# Altium schematic sheet x-Link.SchDoc: =GlobalProjectName
size 594 x 420 mm; CheckedBy: A_D; Author: A_D; SheetTotal: 1; PageSetup: Record=PageOptions|CenterHorizontal=True|CenterVertical=True|PrintScale=0.70|XCorrection=1.00|YCorrection=1.00|PrintKind=2|BorderSize=5000000|LeftOffset=9000|BottomOffset=10100|Orientation=2|PaperLength=11176|PaperWidth=8636|Scale=100|PaperSource=259|PrintQuality=-3|MediaType=1|DitherType=10|PrintScaleMode=1|PaperKind=A3|PaperIndex=8
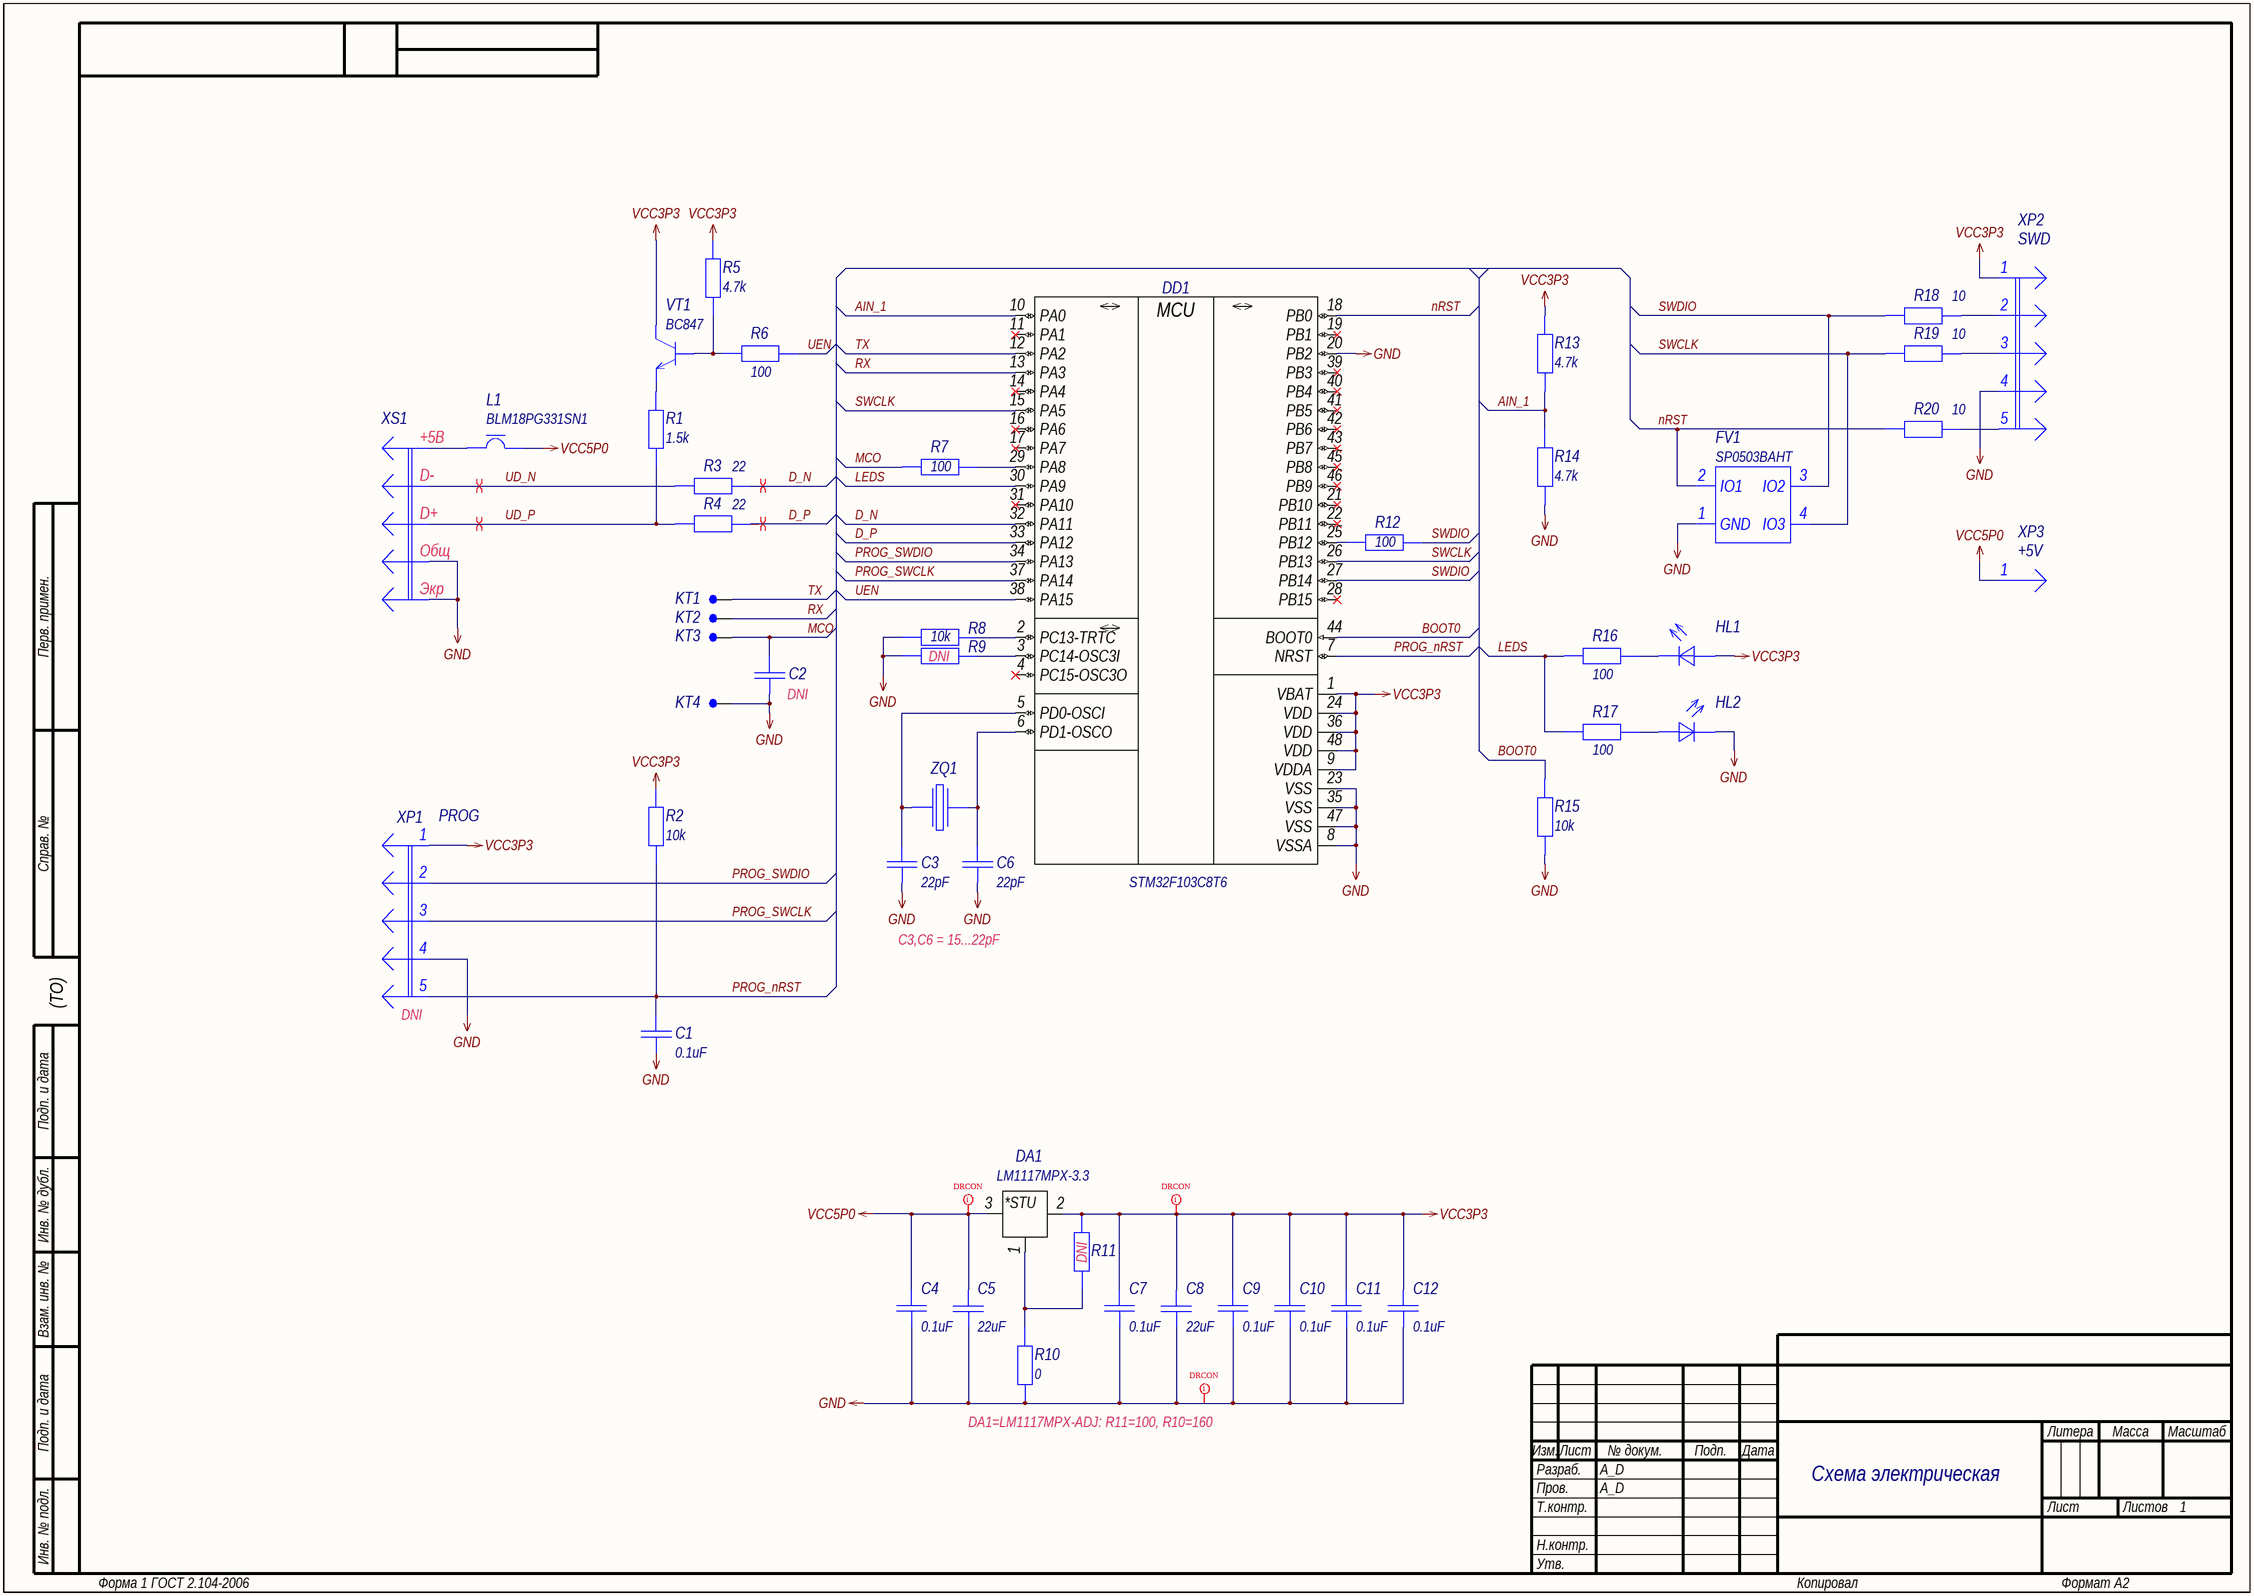
[diagram p0: x-Link.SchDoc]

## Parts
C1  value 0.1uF  [C0603_L]  (hidden comment: Capacitor)
C2  Capacitor  [C0603_L]  (value not drawn)  (no BOM)
C3  value 22pF  [C0603_L]  (hidden comment: Capacitor)
C4  value 0.1uF  [C0603_L]  (hidden comment: Capacitor)
C5  value 22uF  [C0805_L]  (hidden comment: Capacitor)
C6  value 22pF  [C0603_L]  (hidden comment: Capacitor)
C7  value 0.1uF  [C0603_L]  (hidden comment: Capacitor)
C8  value 22uF  [C0805_L]  (hidden comment: Capacitor)
C9  value 0.1uF  [C0603_L]  (hidden comment: Capacitor)
C10  value 0.1uF  [C0603_L]  (hidden comment: Capacitor)
C11  value 0.1uF  [C0603_L]  (hidden comment: Capacitor)
C12  value 0.1uF  [C0603_L]  (hidden comment: Capacitor)
DA1  value LM1117MPX-3.3  [SOT-223]  (hidden comment: LM1117-Series)
DD1  value STM32F103C8T6  [LQFP-48]  (hidden comment: STM32F103Cxxx-Series)
FV1  SP0503BAHT  [SOT-143]
HL1  Text  [LD0603_L]  (value not drawn)
HL2  Text  [LD0603_L]  (value not drawn)
KT1  TX  [TP-SMT-C-1mm-1]  (value not drawn)  (no BOM)
KT2  RX  [TP-SMT-C-1mm-1]  (value not drawn)  (no BOM)
KT3  MCO  [TP-SMT-C-1mm-1]  (value not drawn)  (no BOM)
KT4  GND  [TP-SMT-C-1mm-1]  (value not drawn)  (no BOM)
L1  value BLM18PG331SN1  [L0603_L]  (hidden comment: FerriteBead)
R1  value 1.5k  [R0603_L]  (hidden comment: Resistor)
R2  value 10k  [R0603_L]  (hidden comment: Resistor)
R3  value 22  [R0603_L]  (hidden comment: Resistor)
R4  value 22  [R0603_L]  (hidden comment: Resistor)
R5  value 4.7k  [R0603_L]  (hidden comment: Resistor)
R6  value 100  [R0603_L]  (hidden comment: Resistor)
R7  value 100  [R0603_L]  (hidden comment: Resistor)
R8  value 10k  [R0603_L]  (hidden comment: Resistor)
R9  Resistor  [R0603_L]  (value not drawn)  (no BOM)
R10  value 0  [R0603_L]  (hidden comment: Resistor)
R11  Resistor  [R0603_L]  (value not drawn)  (no BOM)
R12  value 100  [R0603_L]  (hidden comment: Resistor)
R13  value 4.7k  [R0603_L]  (hidden comment: Resistor)
R14  value 4.7k  [R0603_L]  (hidden comment: Resistor)
R15  value 10k  [R0603_L]  (hidden comment: Resistor)
R16  value 100  [R0603_L]  (hidden comment: Resistor)
R17  value 100  [R0603_L]  (hidden comment: Resistor)
R18  value 10  [R0603_L]  (hidden comment: Resistor)
R19  value 10  [R0603_L]  (hidden comment: Resistor)
R20  value 10  [R0603_L]  (hidden comment: Resistor)
VT1  value BC847  [SOT-23]  (hidden comment: BJT-NPN)
XP1  PROG  [PLS-5]  (no BOM)
XP2  SWD  [PLS-5]
XP3  +5V  [PLS-1]
XS1  Text  [DS1097]  (value not drawn)
ZQ1  Crystal  [SMD 5x3.2mm]  (value not drawn)

## Nets
GND: C1.1 C2.1 C3.1 C4.1 C5.2 C6.1 C7.1 C8.2 C9.1 C10.1 C11.1 C12.1 DD1.8(VSSA) DD1.20(PB2) DD1.23(VSS) DD1.35(VSS) DD1.47(VSS) FV1.1(GND) HL2.2(К) KT4.1 R8.1 R9.1 R10.1 R14.1 R15.1 XP1.4 XP2.4 XS1.4 XS1.5
VCC3P3: C7.2 C8.1 C9.2 C10.2 C11.2 C12.2 DA1.2(Out) DD1.1(VBAT) DD1.9(VDDA) DD1.24(VDD) DD1.36(VDD) DD1.48(VDD) HL1.1(А) R2.1 R5.2 R11.2 R13.2 VT1.2(К) XP1.1 XP2.1
VCC5P0: C4.2 C5.1 DA1.3(In) L1.2 XP3.1
AIN_1: DD1.10(PA0) R13.1 R14.2
BOOT0: DD1.44(BOOT0) R15.2
D_N: DD1.32(PA11) R3.2
D_P: DD1.33(PA12) R4.2
LEDS: DD1.30(PA9) R16.2 R17.2
MCO: C2.2 KT3.1 R7.2
nRST: DD1.18(PB0) FV1.2(IO1) R20.1
PROG_nRST: C1.2 DD1.7(NRST) R2.2 XP1.5
PROG_SWCLK: DD1.37(PA14) XP1.3
PROG_SWDIO: DD1.34(PA13) XP1.2
RX: DD1.13(PA3) KT2.1
SWCLK: DD1.15(PA5) DD1.26(PB13) FV1.4(IO3) R19.1
SWDIO: DD1.27(PB14) FV1.3(IO2) R12.2 R18.1
TX: DD1.12(PA2) KT1.1
UD_N: R3.1 XS1.2
UD_P: R1.1 R4.1 XS1.3
UEN: DD1.38(PA15) R6.1
NetC3_2: C3.2 DD1.5(PD0-OSCI) ZQ1.1
NetC6_2: C6.2 DD1.6(PD1-OSCO) ZQ1.3
NetDA1_1: DA1.1(Adj/GND) R10.2 R11.1
NetDD1_2: DD1.2(PC13-TRTC) R8.2
NetDD1_3: DD1.3(PC14-OSC3I) R9.2
NetDD1_25: DD1.25(PB12) R12.1
NetDD1_29: DD1.29(PA8) R7.1
NetHL1_2: HL1.2(К) R16.1
NetHL2_1: HL2.1(А) R17.1
NetL1_1: L1.1 XS1.1
NetR1_2: R1.2 VT1.3(Э)
NetR5_1: R5.1 R6.2 VT1.1(Б)
NetR18_2: R18.2 XP2.2
NetR19_2: R19.2 XP2.3
NetR20_2: R20.2 XP2.5

Not connected (* = marked no-connect by the designer): DD1 4(PC15-OSC3O)* 11(PA1)* 14(PA4)* 16(PA6)* 17(PA7)* 19(PB1)* 21(PB10)* 22(PB11)* 28(PB15)* 31(PA10)* 39(PB3)* 40(PB4)* 41(PB5)* 42(PB6)* 43(PB7)* 45(PB8)* 46(PB9)*

## Layout directives
rule Polygon Connect Style [Style - Direct Connect]: GND, VCC3P3, VCC5P0
differential pair: D_N, D_P, UD_N, UD_P

## Notes on the sheet
- (near C2) DNI
- (near R9) DNI
- C3,C6 = 15...22pF
- (ТО)
- (near XP1) DNI
- (near R11) DNI
- (near R10) DA1=LM1117MPX-ADJ: R11=100, R10=160
- Схема электрическая
  принципиальная
- Перв. примен.
- Справ. №
- Подп. и дата
- Инв. № дубл.
- Взам. инв. №
- Разраб.
- Изм.
- Лист
- № докум.
- Подп.
- Дата
- Литера
- Масса
- Масштаб
- Пров.
- Т.контр.
- Листов
- Инв. № подл.
- Н.контр.
- Утв.
- Форма 1 ГОСТ 2.104-2006
- Копировал
- Формат А2
- (in symbol DS1097-B) +5В; D-; D+; Общ; Экр
- (in symbol LM1117MPX-3.3) *STU
- (in symbol STM32F103C8T6) MCU

## Library data of the parts
C1 C4 C7 C9-C12 = GRM188R71C104KA01D: Manufacturer: Murata; Type: Конденсатор; ID: 131; Voltage: 16V; Tolerance: ±10%; Dielectric Type: X7R; Application Category: 1; Working Temperature Min: -55°С; Working Temperature Max: +125°С; Published: 18.05.2010; Publisher: Andrew Danich; Part Number: GRM188R71C104KA01D; Footprint: 0603
C2 = GRM1885C1H220JA01D: Manufacturer: Murata; Type: Конденсатор; ID: 122; Value: 22pF; Voltage: 50V; Tolerance: ±5%; Dielectric Type: NP0; Application Category: 1; Working Temperature Min: -55°С; Working Temperature Max: +125°С; Published: 18.05.2010; Publisher: Andrew Danich; Part Number: GRM1885C1H220JA01D; Footprint: 0603
C3 C6 = GRM1885C1H220JA01D: Manufacturer: Murata; Type: Конденсатор; ID: 122; Voltage: 50V; Tolerance: ±5%; Dielectric Type: NP0; Application Category: 1; Working Temperature Min: -55°С; Working Temperature Max: +125°С; Published: 18.05.2010; Publisher: Andrew Danich; Part Number: GRM1885C1H220JA01D; Footprint: 0603
C5 C8 = GRM21BR60J226ME39L: Manufacturer: Murata; Type: Конденсатор; ID: 140; Voltage: 6.3V; Tolerance: ±20%; Dielectric Type: X5R; Application Category: 1; Working Temperature Min: -55°С; Working Temperature Max: +85°С; Published: 18.05.2010; Publisher: Andrew Danich; Part Number: GRM21BR60J226ME39L; Footprint: 0805
DA1 = LM1117MPX-3.3: ID: 9; Input Voltage: +8.5…20V; Output Current: 800mA; Output Voltage: +3.3V; Published: 13.08.2015; Publisher: Andrew Danich; Type: Микросхема; Part Number: LM1117MPX-3.3
DD1 = STM32F103C8T6: Manufacturer: STMicroelectronics; ID: 20; Supply Operation: +2.0…3.6V; Flash: 64K; SRAM: 20K; Prog Interface: SWD, UART; I/O Lines: 37; Operation Frequency: 72MHz; Application Category: 1; Working Temperature Min: -40°С; Working Temperature Max: +85°С; Published: 16.10.2015; Publisher: Andrew Danich; Type: Микросхема; Part Number: STM32F103C8T6
FV1 = SP0503BAHT: Manufacturer: LittleFuse; ID: 7; Breakdown Voltage: 6.8V; Reverse Stand Off Voltage: 5.5V; Junction Capacitance: 30pF; Directional: Bidirectional; Application Category: 1; Working Temperature Min: -40°С; Working Temperature Max: +85°С; Published: 11.04.2016; Publisher: Andrew Danich; Type: Супрессор; Part Number: SP0503BAHT; Value: SP0503BAHT; Functional Analog: -
HL1 = BL-LS0603GC: Type: Индикатор единичный; ID: 14; Forward Voltage: 2.3V; Forward Current: 30mA; Power Dissipation: 65mW; Color: Green; Leds: 1; Published: 03.12.2013; Publisher: Andrew Danich; Part Number: BL-LS0603GC; Value: BL-LS0603GC; Footprint: 0603
HL2 = BL-LS0603HC: Type: Индикатор единичный; ID: 13; Forward Voltage: 2.2V; Forward Current: 30mA; Power Dissipation: 65mW; Color: Red; Leds: 1; Published: 03.12.2013; Publisher: Andrew Danich; Part Number: BL-LS0603HC; Value: BL-LS0603HC; Footprint: 0603
KT1-KT4 = КТ-SMT-1: ID: 12; Limit Voltage: 50V; Rated Current: 0.5A; Published: 03.03.2015; Publisher: Andrew Danich; Part Number: КТ-SMT-1; Value: КТ-SMT-1; Application Category: -; Working Temperature Min: -; Working Temperature Max: -; Manufacturer: -; Functional Analog: -
L1 = BLM18PG331SN1: Manufacturer: Murata; Type: Дроссель; ID: 1; Rated Current: 1.2A; Impedance at 100Mhz: 0.15ohm; Inductor Type: EMIFIL; Working Temperature Min: -55°С; Working Temperature Max: +125°С; Published: 14.11.2014; Publisher: Andrew Danich; Part Number: BLM18PG331SN1; DC Resistance: 0.15ohm; Footprint: 0603; Application Category: 1
R1 = RC0603JR-071K5L: Manufacturer: Yageo; ID: 8; Limit Voltage: 50V; Tolerance: ±5%; Temperature Coefficient: 100ppm; Total Power Dissipation: 0.1W; Series Type: Thick-Film; Application Category: 1; Working Temperature Min: -55°С; Working Temperature Max: +155°С; Published: 24.03.2010; Publisher: Andrew Danich; Type: Резистор; Part Number: RC0603JR-071K5L; Footprint: 0603
R2 R8 R15 = RC0603JR-0710KL: Manufacturer: Yageo; ID: 12; Limit Voltage: 50V; Tolerance: ±5%; Temperature Coefficient: 100ppm; Total Power Dissipation: 0.1W; Series Type: Thick-Film; Application Category: 1; Working Temperature Min: -55°С; Working Temperature Max: +155°С; Functional Analog: CR0603-JW-103E; Published: 24.03.2010; Publisher: Andrew Danich; Type: Резистор; Part Number: RC0603JR-0710KL; Footprint: 0603
R3 R4 = RC0603JR-0722RL: Manufacturer: Yageo; ID: 29; Limit Voltage: 50V; Tolerance: ±5%; Temperature Coefficient: 100ppm; Total Power Dissipation: 0.1W; Series Type: Thick-Film; Application Category: 1; Working Temperature Min: -55°С; Working Temperature Max: +155°С; Published: 24.03.2010; Publisher: Andrew Danich; Type: Резистор; Part Number: RC0603JR-0722RL; Footprint: 0603
R5 R13 R14 = RC0603JR-074K7L: Manufacturer: Yageo; ID: 56; Limit Voltage: 50V; Tolerance: ±5%; Temperature Coefficient: 100ppm; Total Power Dissipation: 0.1W; Series Type: Thick-Film; Application Category: 1; Working Temperature Min: -55°С; Working Temperature Max: +155°С; Published: 24.03.2010; Publisher: Andrew Danich; Type: Резистор; Part Number: RC0603JR-074K7L; Footprint: 0603
R6 R7 R12 R16 R17 = RC0603JR-07100R: Manufacturer: Yageo; ID: 10; Limit Voltage: 50V; Tolerance: ±5%; Temperature Coefficient: 100ppm; Total Power Dissipation: 0.1W; Series Type: Thick-Film; Application Category: 1; Working Temperature Min: -55°С; Working Temperature Max: +155°С; Functional Analog: CR0603-JW-101E; Published: 24.03.2010; Publisher: Andrew Danich; Type: Резистор; Part Number: RC0603JR-07100R; Footprint: 0603
R9 = RC0603JR-0710KL: Manufacturer: Yageo; ID: 12; Value: 10k; Limit Voltage: 50V; Tolerance: ±5%; Temperature Coefficient: 100ppm; Total Power Dissipation: 0.1W; Series Type: Thick-Film; Application Category: 1; Working Temperature Min: -55°С; Working Temperature Max: +155°С; Functional Analog: CR0603-JW-103E; Published: 24.03.2010; Publisher: Andrew Danich; Type: Резистор; Part Number: RC0603JR-0710KL; Footprint: 0603
R10 = RC0603JR-070R: Manufacturer: Yageo; ID: 5; Limit Voltage: 50V; Tolerance: ±5%; Temperature Coefficient: 100ppm; Total Power Dissipation: 0.1W; Series Type: Thick-Film; Application Category: 1; Working Temperature Min: -55°С; Working Temperature Max: +155°С; Functional Analog: RC0603FR-070RL, CR0603-J/-000E; Published: 24.03.2010; Publisher: Andrew Danich; Type: Резистор; Part Number: RC0603JR-070R; Footprint: 0603
R11 = RC0603JR-070R: Manufacturer: Yageo; ID: 5; Value: 0; Limit Voltage: 50V; Tolerance: ±5%; Temperature Coefficient: 100ppm; Total Power Dissipation: 0.1W; Series Type: Thick-Film; Application Category: 1; Working Temperature Min: -55°С; Working Temperature Max: +155°С; Functional Analog: RC0603FR-070RL, CR0603-J/-000E; Published: 24.03.2010; Publisher: Andrew Danich; Type: Резистор; Part Number: RC0603JR-070R; Footprint: 0603
R18-R20 = RC0603JR-0710RL: Manufacturer: Yageo; ID: 9; Limit Voltage: 50V; Tolerance: ±5%; Temperature Coefficient: 100ppm; Total Power Dissipation: 0.1W; Series Type: Thick-Film; Application Category: 1; Working Temperature Min: -55°С; Working Temperature Max: +155°С; Functional Analog: CR0603-JW-100E; Published: 24.03.2010; Publisher: Andrew Danich; Type: Резистор; Part Number: RC0603JR-0710RL; Footprint: 0603
VT1 = BC847: Type: Транзистор; ID: 1; C-E Voltage: 45V; Collector Current: 100mA; C-E Saturation Voltage: 0.6V; DC Current Gain: 110…800; Total Power Dissipation: 250mW; Transition Frequency: 100MHz; Published: 07.05.2013; Publisher: Andrew Danich; Part Number: BC847; Application Category: 1
XP1 XP2 = PLS-5: Value: PLS-5; ID: 4; Limit Voltage: 250V; Limit Current: 3A; Connector Type: Male; Resistance: 15momh; Surface Finish: Gold; Pitch: 2.54mm; Published: 07.03.2013; Publisher: Andrew Danich; Type: Вилка; Part Number: PLS-5; Pins: 5
XP3 = PLS-1: Value: PLS-1; ID: 8; Limit Voltage: 250V; Limit Current: 3A; Connector Type: Male; Resistance: 15momh; Surface Finish: Gold; Pitch: 2.54mm; Published: 07.03.2013; Publisher: Andrew Danich; Type: Вилка; Part Number: PLS-1; Pins: 1
XS1 = DS1097-B: Manufacturer: Connfly Electronic Co., Ltd; ID: 3; Limit Voltage: 30V; Limit Current: 1.5A; Connector Type: Male; Interface: USB 2.0; Max Data Rate: 480 mbps; Application Category: 1; Functional Analog: USB-AR, DS1097-W; Published: 13.08.2015; Publisher: Andrew Danich; Type: Вилка; Part Number: DS1097-B; Value: DS1097-B; Pins: 6; Mount Type: Through hole
ZQ1 = KX-9A 8.0 MHz 30/50/100 16 pF: Manufacturer: Geyer; ID: 12; Output Frequency: 8MHz; Shunt Capacitance: 5pF; Load Capacitance: 16pF; Temperature Coefficient: ±50ppm; Application Category: 1; Working Temperature Min: -20°С; Working Temperature Max: +70°С; Published: 08.03.2013; Publisher: Andrew Danich; Type: Резонатор; Part Number: KX-9A 8.0 MHz 30/50/100 16 pF; Value: KX-9A 8.0 MHz 30/50/100 16 pF; Functional Analog: -